# Altium project TC264主板1.2.PrjPcb
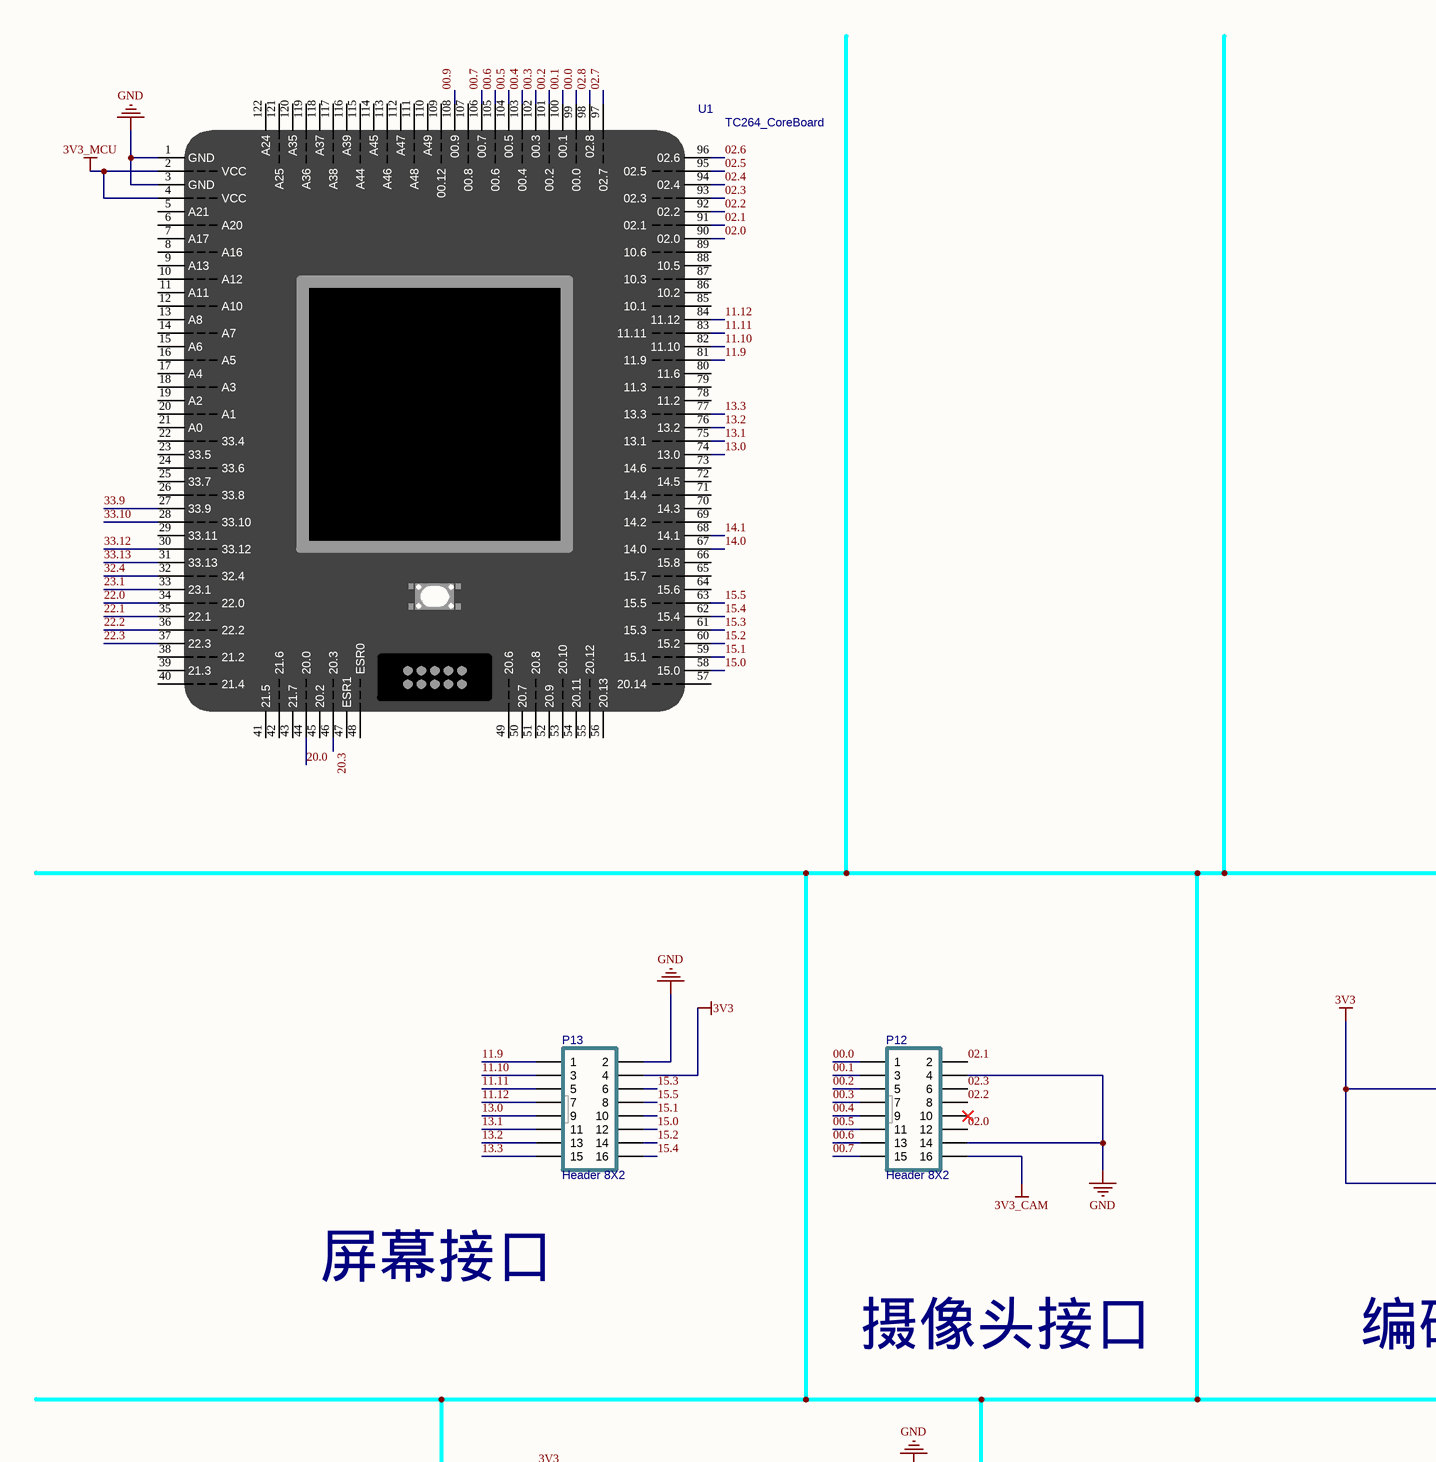
[diagram p0: TC264Main.SchDoc, top left]
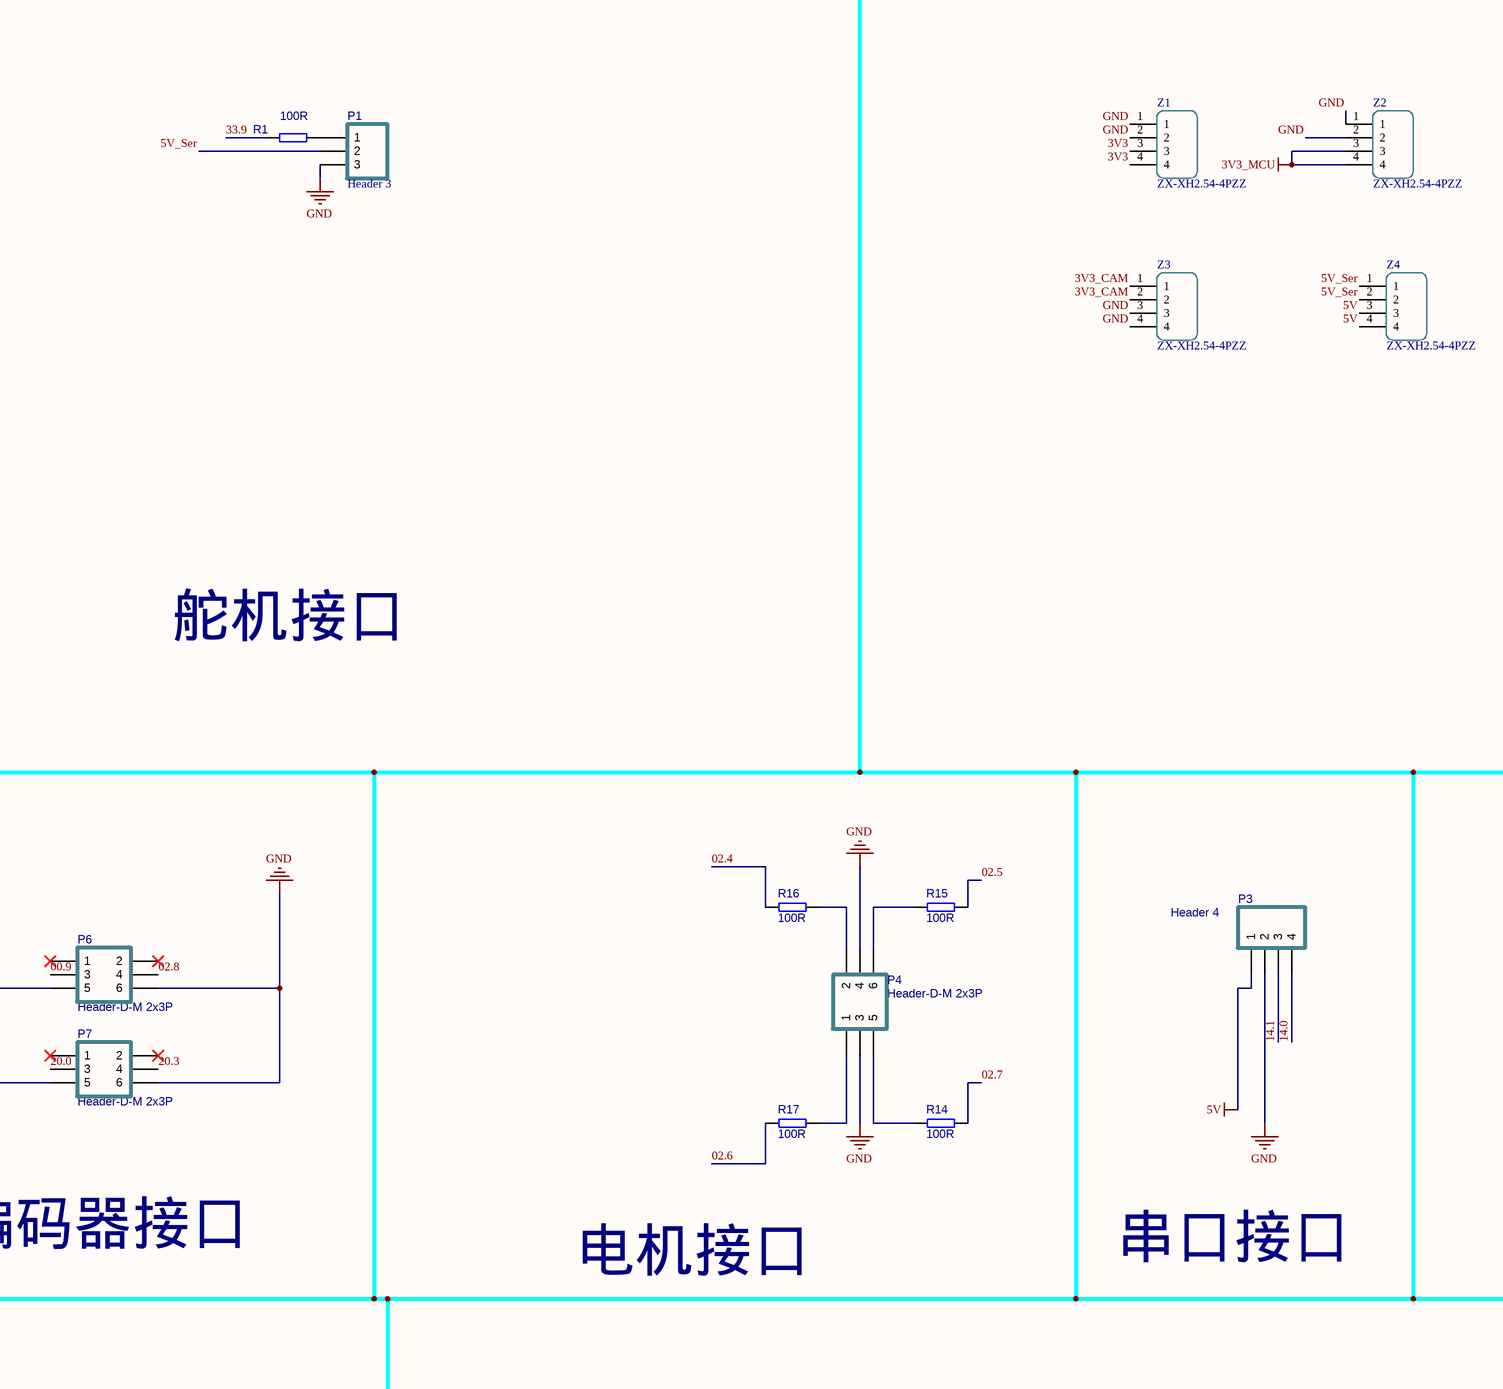
[diagram p1: TC264Main.SchDoc, top middle]
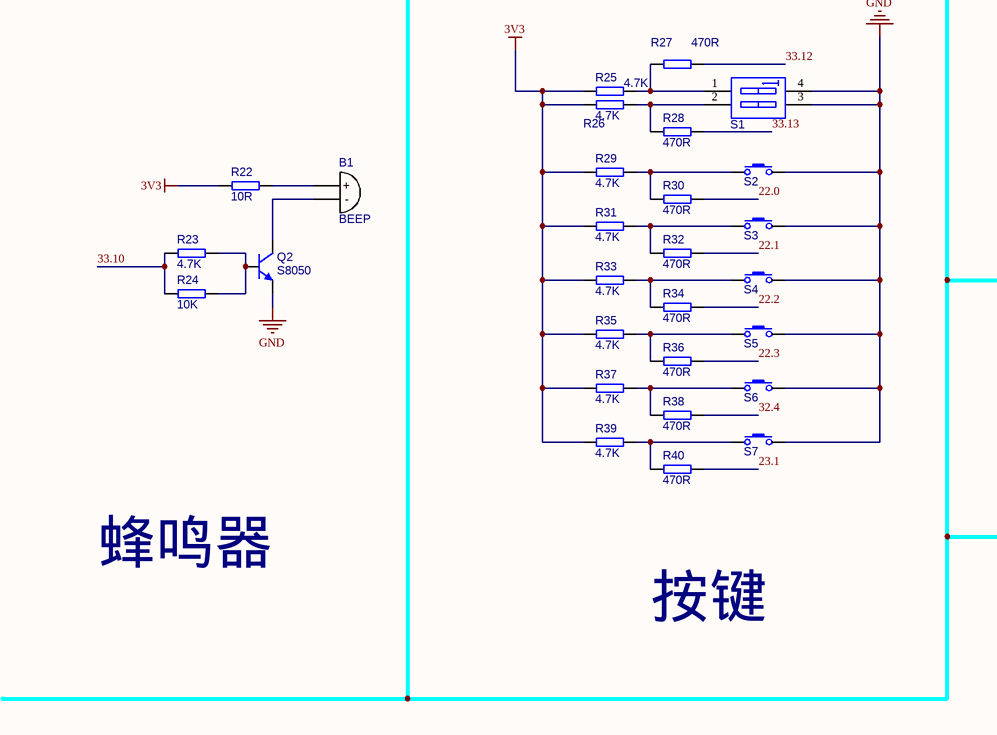
[diagram p2: TC264Main.SchDoc, bottom left]
1 sheet, 45 parts. Net scope: global (net labels, ports and power ports of the same name join across sheets).
Board file: TC264Main.PcbDoc

## Sheet TC264Main.SchDoc
size A1; SheetNumber: 1; SheetTotal: 1

### Parts
B1  BEEP  [BEEP 9x5.5mm]
P1  Header 3  [HDR1X3]
P3  Header 4  [HDR1X4]
P4  Header-D-M 2x3P  [HDR2X3-M]
P6  Header-D-M 2x3P  [HDR2X3-M]
P7  Header-D-M 2x3P  [HDR2X3-M]
P12  Header 8X2  [HDR2X8]
P13  Header 8X2  [HDR2X8]
Q2  S8050  [SOT-23]
R1  value 100R  [RESC1608[0603]S-N]  (hidden comment: 100R ±1%)
R14  value 100R  [RESC1608[0603]S-N]  (hidden comment: 100R ±1%)
R15  value 100R  [RESC1608[0603]S-N]  (hidden comment: 100R ±1%)
R16  value 100R  [RESC1608[0603]S-N]  (hidden comment: 100R ±1%)
R17  value 100R  [RESC1608[0603]S-N]  (hidden comment: 100R ±1%)
R22  value 10R  [RESC1608[0603]S-N]  (hidden comment: 10R ±1%)
R23  value 4.7K  [RESC1608[0603]S-N]  (hidden comment: 4.7K ±1%)
R24  value 10K  [RESC1608[0603]S-N]  (hidden comment: 10K ±1%)
R25  value 4.7K  [RESC1608[0603]S-N]  (hidden comment: 4.7K ±1%)
R26  value 4.7K  [RESC1608[0603]S-N]  (hidden comment: 4.7K ±1%)
R27  value 470R  [RESC1608[0603]S-N]  (hidden comment: 470R ±1%)
R28  value 470R  [RESC1608[0603]S-N]  (hidden comment: 470R ±1%)
R29  value 4.7K  [RESC1608[0603]S-N]  (hidden comment: 4.7K ±1%)
R30  value 470R  [RESC1608[0603]S-N]  (hidden comment: 470R ±1%)
R31  value 4.7K  [RESC1608[0603]S-N]  (hidden comment: 4.7K ±1%)
R32  value 470R  [RESC1608[0603]S-N]  (hidden comment: 470R ±1%)
R33  value 4.7K  [RESC1608[0603]S-N]  (hidden comment: 4.7K ±1%)
R34  value 470R  [RESC1608[0603]S-N]  (hidden comment: 470R ±1%)
R35  value 4.7K  [RESC1608[0603]S-N]  (hidden comment: 4.7K ±1%)
R36  value 470R  [RESC1608[0603]S-N]  (hidden comment: 470R ±1%)
R37  value 4.7K  [RESC1608[0603]S-N]  (hidden comment: 4.7K ±1%)
R38  value 470R  [RESC1608[0603]S-N]  (hidden comment: 470R ±1%)
R39  value 4.7K  [RESC1608[0603]S-N]  (hidden comment: 4.7K ±1%)
R40  value 470R  [RESC1608[0603]S-N]  (hidden comment: 470R ±1%)
S1  SW DIP-2  [Code SW-2-DIP-2.54]  (value not drawn)
S2  Button  [PTS810-3*4-CurvePin]  (value not drawn)
S3  Button  [PTS810-3*4-CurvePin]  (value not drawn)
S4  Button  [PTS810-3*4-CurvePin]  (value not drawn)
S5  Button  [PTS810-3*4-CurvePin]  (value not drawn)
S6  Button  [PTS810-3*4-CurvePin]  (value not drawn)
S7  Button  [PTS810-3*4-CurvePin]  (value not drawn)
U1  TC264_CoreBoard  [TC264_CoreBoard - duplicate]
Z1  ZX-XH2.54-4PZZ  [ZX-XH2.54-4PZZ]
Z2  ZX-XH2.54-4PZZ  [ZX-XH2.54-4PZZ]
Z3  ZX-XH2.54-4PZZ  [ZX-XH2.54-4PZZ]
Z4  ZX-XH2.54-4PZZ  [ZX-XH2.54-4PZZ]

### Nets
3V3: P6.5 P7.5 P13.4 R22.1 R25.1 R26.1 R29.1 R31.1 R33.1 R35.1 R37.1 R39.1 Z1.3 Z1.4
3V3_CAM: P12.16 Z3.1 Z3.2
3V3_MCU: U1.2(VCC) U1.4(VCC) Z2.3 Z2.4
5V: P3.1 Z4.3 Z4.4
GND: P1.3 P3.2 P4.3 P4.4 P6.6 P7.6 P12.4 P12.14 P13.2 Q2.2(E) S1.3(B2) S1.4(B1) S2.1 S3.1 S4.1 S5.1 S6.1 S7.1 U1.1(GND) U1.3(GND) Z1.1 Z1.2 Z2.1 Z2.2 Z3.3 Z3.4
00.0: P12.1 U1.99(00.0)
00.1: P12.3 U1.100(00.1)
00.2: P12.5 U1.101(00.2)
00.3: P12.7 U1.102(00.3)
00.4: P12.9 U1.103(00.4)
00.5: P12.11 U1.104(00.5)
00.6: P12.13 U1.105(00.6)
00.7: P12.15 U1.106(00.7)
00.9: P6.3 U1.108(00.9)
02.0: P12.12 U1.90(02.0)
02.1: P12.2 U1.91(02.1)
02.2: P12.8 U1.92(02.2)
02.3: P12.6 U1.93(02.3)
02.4: R16.1 U1.94(02.4)
02.5: R15.2 U1.95(02.5)
02.6: R17.1 U1.96(02.6)
02.7: R14.2 U1.97(02.7)
02.8: P6.4 U1.98(02.8)
5V_Ser: P1.2 Z4.1 Z4.2
11.9: P13.1 U1.81(11.9)
11.10: P13.3 U1.82(11.10)
11.11: P13.5 U1.83(11.11)
11.12: P13.7 U1.84(11.12)
13.0: P13.9 U1.74(13.0)
13.1: P13.11 U1.75(13.1)
13.2: P13.13 U1.76(13.2)
13.3: P13.15 U1.77(13.3)
14.0: P3.4 U1.67(14.0)
14.1: P3.3 U1.68(14.1)
15.0: P13.12 U1.58(15.0)
15.1: P13.10 U1.59(15.1)
15.2: P13.14 U1.60(15.2)
15.3: P13.6 U1.61(15.3)
15.4: P13.16 U1.62(15.4)
15.5: P13.8 U1.63(15.5)
20.0: P7.3 U1.44(20.0)
20.3: P7.4 U1.46(20.3)
22.0: R30.2 U1.34(22.0)
22.1: R32.2 U1.35(22.1)
22.2: R34.2 U1.36(22.2)
22.3: R36.2 U1.37(22.3)
23.1: R40.2 U1.33(23.1)
32.4: R38.2 U1.32(32.4)
33.9: R1.1 U1.27(33.9)
33.10: R23.1 R24.1 U1.28(33.10)
33.12: R27.2 U1.30(33.12)
33.13: R28.2 U1.31(33.13)
NetB1_1: B1.1(+) R22.2
NetB1_2: B1.2(-) Q2.3(C)
NetP1_1: P1.1 R1.2
NetP4_1: P4.1 R17.2
NetP4_2: P4.2 R16.2
NetP4_5: P4.5 R14.1
NetP4_6: P4.6 R15.1
NetQ2_1: Q2.1(B) R23.2 R24.2
NetR25_2: R25.2 R27.1 S1.1(A1)
NetR26_2: R26.2 R28.1 S1.2(A2)
NetR29_2: R29.2 R30.1 S2.2
NetR31_2: R31.2 R32.1 S3.2
NetR33_2: R33.2 R34.1 S4.2
NetR35_2: R35.2 R36.1 S5.2
NetR37_2: R37.2 R38.1 S6.2
NetR39_2: R39.2 R40.1 S7.2

Not connected (* = marked no-connect by the designer): P6 1* 2*; P7 1* 2*; P12 10*; U1 5(A21) 6(A20) 7(A17) 8(A16) 9(A13) 10(A12) 11(A11) 12(A10) 13(A8) 14(A7) 15(A6) 16(A5) 17(A4) 18(A3) 19(A2) 20(A1) 21(A0) 22(33.4) 23(33.5) 24(33.6) 25(33.7) 26(33.8) 29(33.11) 38(21.2) 39(21.3) 40(21.4) 41(21.5) 42(21.6) 43(21.7) 45(20.2) 47(ESR1) 48(ESR0) 49(20.6) 50(20.7) 51(20.8) 52(20.9) 53(20.10) 54(20.11) 55(20.12) 56(20.13) 57(20.14) 64(15.6) 65(15.7) 66(15.8) 69(14.2) 70(14.3) 71(14.4) 72(14.5) 73(14.6) 78(11.2) 79(11.3) 80(11.6) 85(10.1) 86(10.2) 87(10.3) 88(10.5) 89(10.6) 107(00.8) 109(00.12) 110(A49) 111(A48) 112(A47) 113(A46) 114(A45) 115(A44) 116(A39) 117(A38) 118(A37) 119(A36) 120(A35) 121(A25) 122(A24)

### Notes on the sheet
- 舵机接口
- 屏幕接口
- 摄像头接口
- 编码器接口
- 电机接口
- 串口接口
- 蜂鸣器
- 按键

### Library data of the parts
B1 = BEEP: 蜂鸣器
P1 = Header 3: Header, 3-Pin; LatestRevisionDate: 17-Jul-2002; LatestRevisionNote: Re-released for DXP Platform.; Publisher: Altium Limited; Price(RMB): 0.00
P3 = Header 4: Header, 4-Pin; LatestRevisionDate: 17-Jul-2002; LatestRevisionNote: Re-released for DXP Platform.; Publisher: Altium Limited; Price(RMB): 0.00
P4 P6 P7 = Header-D-M 2x3P: 2x3pin, 直插, 双排针; Revision: V1.0; Value: Header-D-M 2x3P
P12 P13 = Header 8X2: Header, 8-Pin, Dual row; LatestRevisionDate: 17-Jul-2002; LatestRevisionNote: Re-released for DXP Platform.; Publisher: Altium Limited; Price(RMB): 0.00
Q2 = NPN S8050: Discrete NPN Bipolar Transistor; Published: 8-Jun-2000; Revision: July-2002: Re-released for DXP Platform.; Publisher: Altium Limited; Price(RMB): 0.000; PartNumber: S8050
R1 R14-R17 = Res-Chip_1: 贴片电阻; Published: 8-Jun-2000; Revision: July-2002: Re-released for DXP Platform.; Tolerance: ±1%
R22 = Res-Chip_10: 贴片电阻; Published: 8-Jun-2000; Revision: July-2002: Re-released for DXP Platform.; Tolerance: ±1%
R23 R25 R26 R29 R31 R33 R35 R37 R39 = Res-Chip_4: 贴片电阻; Published: 8-Jun-2000; Revision: July-2002: Re-released for DXP Platform.; Tolerance: ±1%
R24 = Res-Chip: 贴片电阻; Published: 8-Jun-2000; Revision: July-2002: Re-released for DXP Platform.; Tolerance: ±1%
R27 R28 R30 R32 R34 R36 R38 R40 = Res-Chip_11: 贴片电阻; Published: 8-Jun-2000; Revision: July-2002: Re-released for DXP Platform.; Tolerance: ±1%
S1 = Code SW-2: 2位拨码开关; Published: 24-Mar-1999; Revision: July-2002: Re-released for DXP Platform.; Publisher: Altium Limited; Price(RMB): 0.000
S2-S7 = KEY: 按键; Published: 24-Mar-1999; Publisher: Altium Limited; Price(RMB): 0.000
U1 = TC264_CoreBoard: 逐飞科技TC264核心板
Z1-Z4 = ZX-XH2.54-4PZZ: 接线端子